# EAGLE schematic CIA_Update.brd (EAGLE 9.7.0)
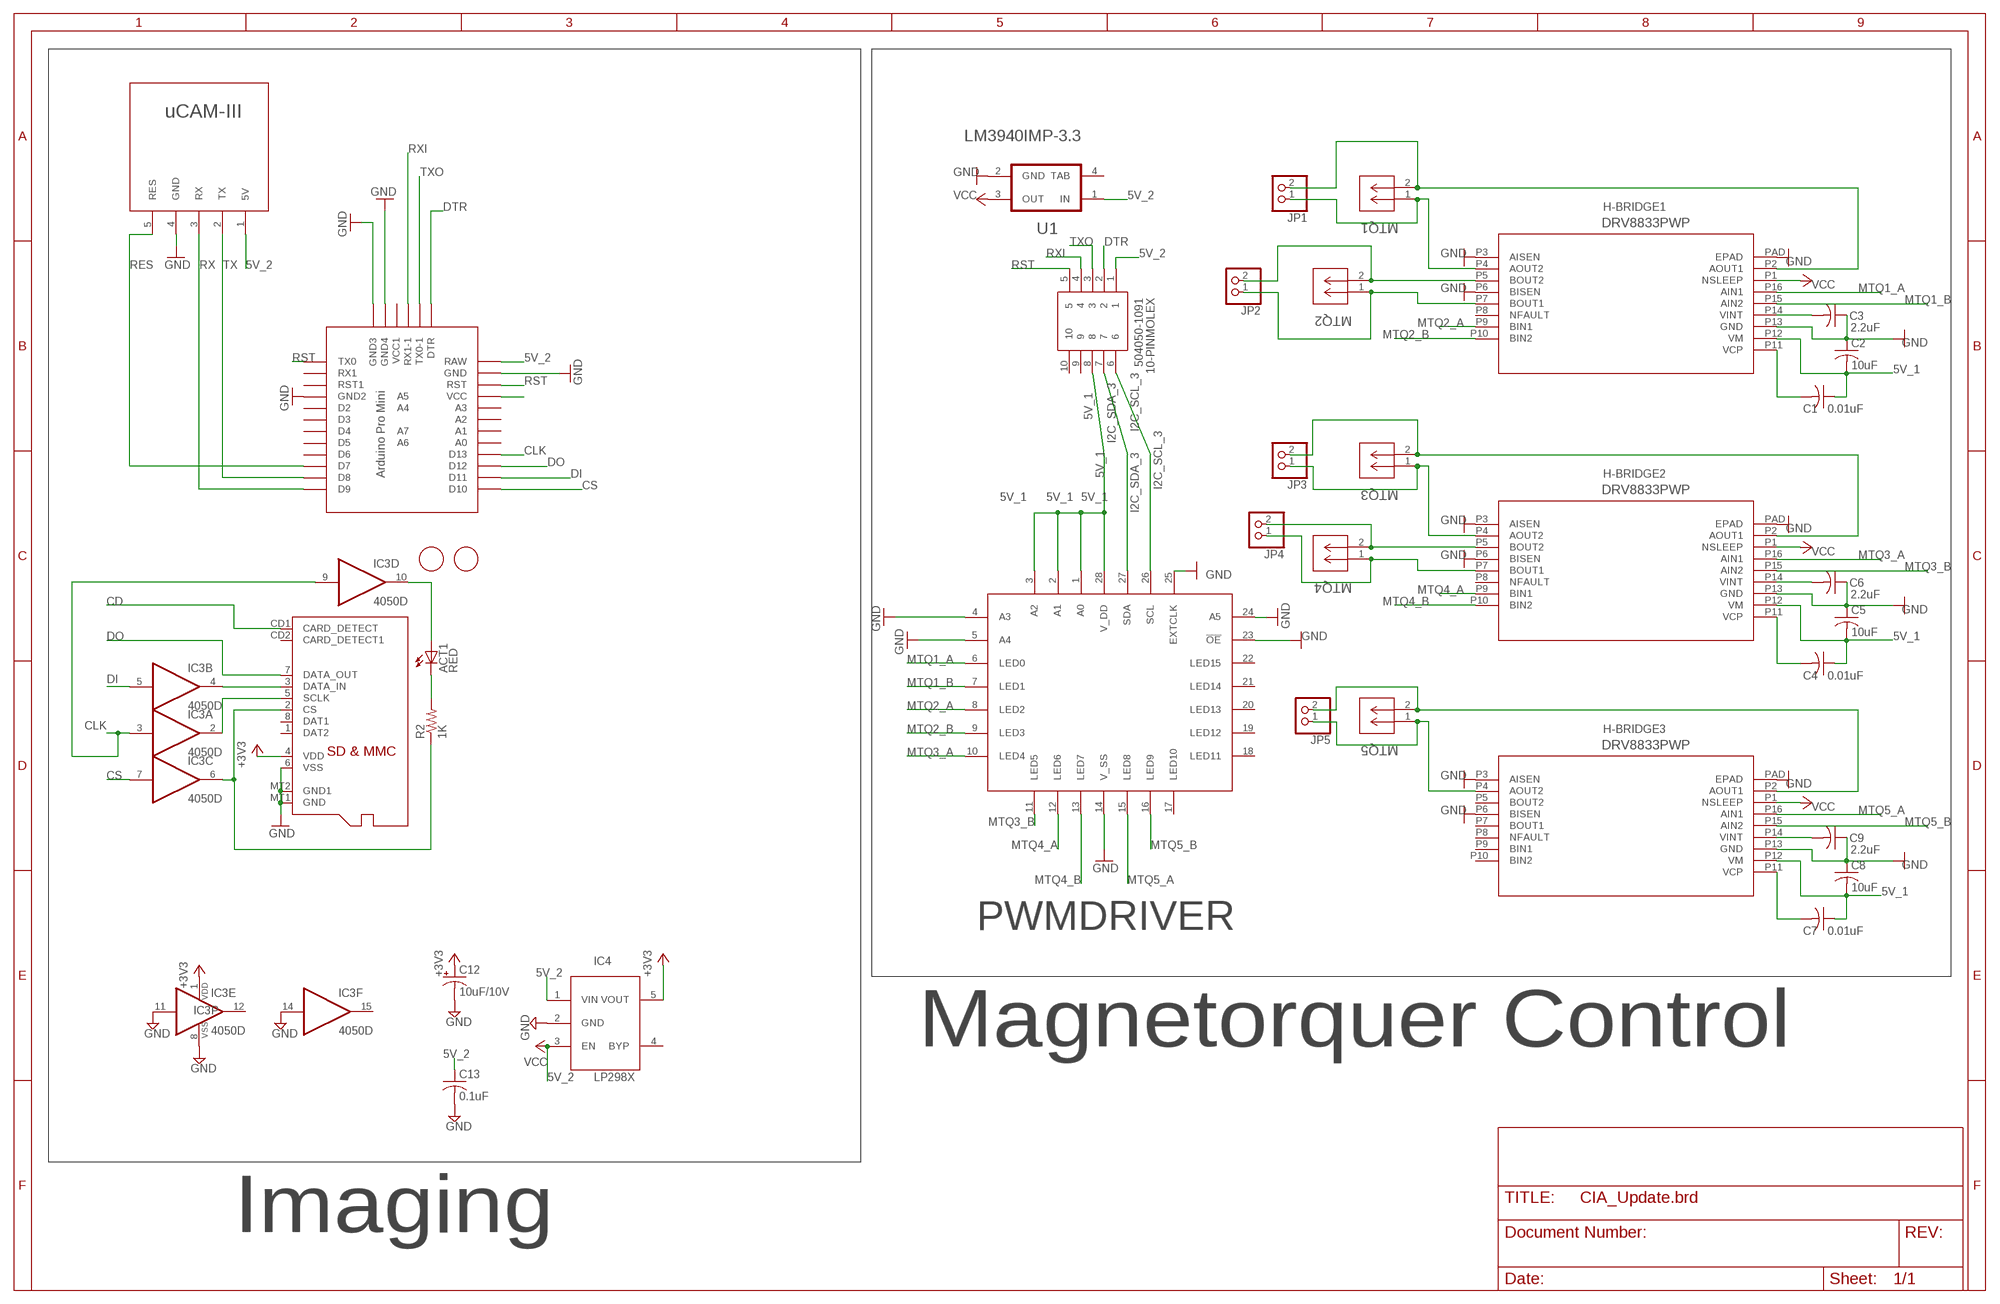
[diagram p0: schematic, sheet 1]

## Parts
10-PINMOLEX  504050-1091  [504050-1091]
ACT1  RED  LEDCHIP-LED0805  [CHIP-LED0805]
C1  0.01uF  C-USC0603K  [C0603K]
C2  10uF  C-USC1210K  [C1210K]
C3  2.2uF  C-USC0603K  [C0603K]
C4  0.01uF  C-USC0603K  [C0603K]
C5  10uF  C-USC1210K  [C1210K]
C6  2.2uF  C-USC0603K  [C0603K]
C7  0.01uF  C-USC0603K  [C0603K]
C8  10uF  C-USC1210K  [C1210K]
C9  2.2uF  C-USC0603K  [C0603K]
C12  10uF/10V  CPOL-USA/3216-18R  [A/3216-18R]
C13  0.1uF  C-USC0805K  [C0805K]
H-BRIDGE1  DRV8833PWP  [HTSSOP16]
H-BRIDGE2  DRV8833PWP  [HTSSOP16]
H-BRIDGE3  DRV8833PWP  [HTSSOP16]
IC3  4050D  [SO16]
IC4  LP298XS  [SOT23-5L]
JP1  PINHD-1X2  [1X02]
JP2  PINHD-1X2  [1X02]
JP3  PINHD-1X2  [1X02]
JP4  PINHD-1X2  [1X02]
JP5  PINHD-1X2  [1X02]
MTQ1  DF13C-2P-1.25V(51)  [CON2_1X2_U_DF13]
MTQ2  DF13C-2P-1.25V(51)  [CON2_1X2_U_DF13]
MTQ3  DF13C-2P-1.25V(51)  [CON2_1X2_U_DF13]
MTQ4  DF13C-2P-1.25V(51)  [CON2_1X2_U_DF13]
MTQ5  DF13C-2P-1.25V(51)  [CON2_1X2_U_DF13]
PWMDRIVER  PCA9685PW  [TSSOP28]
R2  1K  R-US_R0805  [R0805]
U1  TI_NATIONAL_SEMICONDUCTOR_LM3940IMP-3.3TI_NATIONAL_SEMICONDUCTOR_LM3940IMP-3.3_0_1  [TI_NATIONAL_SEMICONDUCTOR_LM3940IMP-3.3_1]
U$2  UCAM-III  [UCAM-III]
U$6  FIDUCIAL  [FIDUCIAL_1MM]
U$7  FIDUCIAL  [FIDUCIAL_1MM]
U$8  PRO-MINI-2  [PRO-MINI-2]
X2  MICROSD  [MICROSD]

## Nets
5V_1 [New Class]: 10-PINMOLEX.8 C1.1 C2.2 C4.1 C5.2 C7.1 C8.2 H-BRIDGE1.P12(VM) H-BRIDGE2.P12(VM) H-BRIDGE3.P12(VM) PWMDRIVER.1(A0) PWMDRIVER.2(A1) PWMDRIVER.3(A2) PWMDRIVER.28(V_DD)
5V_2 [New Class]: 10-PINMOLEX.1 C13.1 IC4.1(VIN) IC4.3(EN) U1.1(IN) U$2.1(5V) U$8.RAW ; supply symbol labelled VCC
+3V3: C12.+ IC3.1(P:VDD) IC4.5(VOUT) X2.4(VDD)
CD: X2.CD1(CARD_DETECT)
CLK: IC3.3(A:I) IC3.9(D:I) U$8.D13
CS: IC3.7(C:I) U$8.D10
DI: IC3.5(B:I) U$8.D11
DO: U$8.D12 X2.7(DATA_OUT)
DTR [MTQs]: 10-PINMOLEX.2 U$8.DTR
GND [MTQs]: C2.1 C3.1 C5.1 C6.1 C8.1 C9.1 C12.- C13.2 H-BRIDGE1.P3(AISEN) H-BRIDGE1.P6(BISEN) H-BRIDGE1.P13(GND) H-BRIDGE1.PAD(EPAD) H-BRIDGE2.P3(AISEN) H-BRIDGE2.P6(BISEN) H-BRIDGE2.P13(GND) H-BRIDGE2.PAD(EPAD) H-BRIDGE3.P3(AISEN) H-BRIDGE3.P6(BISEN) H-BRIDGE3.P13(GND) H-BRIDGE3.PAD(EPAD) IC3.8(P:VSS) IC3.11(E:I) IC3.14(F:I) IC4.2(GND) PWMDRIVER.4(A3) PWMDRIVER.5(A4) PWMDRIVER.14(V_SS) PWMDRIVER.23(!OE) PWMDRIVER.24(A5) PWMDRIVER.25(EXTCLK) U1.2(GND) U$8.GND U$8.GND1(GND2) U$8.GND2(GND3) U$8.GND3(GND4) X2.6(VSS) X2.MT1(GND) X2.MT2(GND1)
I2C_SCL_3: 10-PINMOLEX.6 PWMDRIVER.26(SCL)
I2C_SDA_3: 10-PINMOLEX.7 PWMDRIVER.27(SDA)
MTQ1_A: H-BRIDGE1.P16(AIN1) PWMDRIVER.6(LED0)
MTQ1_B: H-BRIDGE1.P15(AIN2) PWMDRIVER.7(LED1)
MTQ2_A: H-BRIDGE1.P9(BIN1) PWMDRIVER.8(LED2)
MTQ2_B: H-BRIDGE1.P10(BIN2) PWMDRIVER.9(LED3)
MTQ3_A: H-BRIDGE2.P16(AIN1) PWMDRIVER.10(LED4)
MTQ3_B: H-BRIDGE2.P15(AIN2) PWMDRIVER.11(LED5)
MTQ4_A: H-BRIDGE2.P9(BIN1) PWMDRIVER.12(LED6)
MTQ4_B: H-BRIDGE2.P10(BIN2) PWMDRIVER.13(LED7)
MTQ5_A: H-BRIDGE3.P16(AIN1) PWMDRIVER.15(LED8)
MTQ5_B: H-BRIDGE3.P15(AIN2) PWMDRIVER.16(LED9)
N$1 [MTQs]: H-BRIDGE2.P2(AOUT1) JP3.2 MTQ3.2
N$2: C3.2 H-BRIDGE1.P14(VINT)
N$3 [MTQs]: H-BRIDGE1.P4(AOUT2) JP1.1 MTQ1.1
N$4 [MTQs]: H-BRIDGE1.P2(AOUT1) JP1.2 MTQ1.2
N$5 [MTQs]: H-BRIDGE1.P7(BOUT1) JP2.1 MTQ2.1
N$6 [MTQs]: H-BRIDGE1.P5(BOUT2) JP2.2 MTQ2.2
N$7: C1.2 H-BRIDGE1.P11(VCP)
N$8 [MTQs]: H-BRIDGE2.P7(BOUT1) JP4.1 MTQ4.1
N$9 [MTQs]: H-BRIDGE2.P5(BOUT2) JP4.2 MTQ4.2
N$10: C6.2 H-BRIDGE2.P14(VINT)
N$11: C4.2 H-BRIDGE2.P11(VCP)
N$12 [MTQs]: H-BRIDGE2.P4(AOUT2) JP3.1 MTQ3.1
N$13 [MTQs]: H-BRIDGE3.P2(AOUT1) JP5.2 MTQ5.2
N$14 [MTQs]: U$2.4(GND) ; supply symbol labelled GND
N$15: U$8.TX0
N$16: C9.2 H-BRIDGE3.P14(VINT)
N$17: C7.2 H-BRIDGE3.P11(VCP)
N$18 [MTQs]: H-BRIDGE3.P4(AOUT2) JP5.1 MTQ5.1
N$21: U$8.VCC
N$22: ACT1.A IC3.10(D:O)
N$23: IC3.2(A:O) X2.5(SCLK)
N$24: IC3.6(C:O) R2.1 X2.2(CS)
N$25: ACT1.C R2.2
N$26: IC3.4(B:O) X2.3(DATA_IN)
RES: U$2.5(RES) U$8.D7
RST: 10-PINMOLEX.5 U$8.RST
RX: U$2.3(RX) U$8.D9
RXI: 10-PINMOLEX.4 U$8.RX1-1
TX: U$2.2(TX) U$8.D8
TXO: 10-PINMOLEX.3 U$8.TX0-1
VCC: H-BRIDGE1.P1(NSLEEP) H-BRIDGE2.P1(NSLEEP) H-BRIDGE3.P1(NSLEEP) U1.3(OUT)
Unconnected: 10-PINMOLEX.9 10-PINMOLEX.10 H-BRIDGE1.P8(NFAULT) H-BRIDGE2.P8(NFAULT) H-BRIDGE3.P5(BOUT2) H-BRIDGE3.P7(BOUT1) H-BRIDGE3.P8(NFAULT) H-BRIDGE3.P9(BIN1) H-BRIDGE3.P10(BIN2) IC3.12(E:O) IC3.15(F:O) IC4.4(BYP) PWMDRIVER.17(LED10) PWMDRIVER.18(LED11) PWMDRIVER.19(LED12) PWMDRIVER.20(LED13) PWMDRIVER.21(LED14) PWMDRIVER.22(LED15) U$8.A0 U$8.A1 U$8.A2 U$8.A3 U$8.A4 U$8.A5 U$8.A6 U$8.A7 U$8.D2 U$8.D3 U$8.D4 U$8.D5 U$8.D6 U$8.RST1 U$8.RX1 U$8.VCC1 X2.1(DAT2) X2.8(DAT1) X2.CD2(CARD_DETECT1)

## Notes on the sheet
- Magnetorquer Control
- Imaging

## Power pins joined to a net without a drawn wire
TAB: U1.4(TAB)

## Library data of the parts
10-PINMOLEX = molex_10pin:504050-1091: Pico-Lock SMT Wire-to-Board Header 10way Molex 504050 Series, 1.5mm Pitch 10 Way 1 Row Right Angle PCB Header, SMT Termination, 3A Source: Datasheet <https://componentsearchengine.com/Datasheets/1/504050-1091.pdf>; DESCRIPTION: Pico-Lock SMT Wire-to-Board Header 10way Molex 504050 Series, 1.5mm Pitch 10 Way 1 Row Right Angle PCB Header, SMT Termination, 3A; HEIGHT: mm; MANUFACTURER_NAME: Molex; MANUFACTURER_PART_NUMBER: 504050-1091; MOUSER_PART_NUMBER: 538-504050-1091; MOUSER_PRICE-STOCK: https://www.mouser.com/Search/Refine.aspx?Keyword=538-504050-1091; OC_NEWARK: unknown
ACT1 = adafruit:LED: LED OSRAM: - CHIPLED LG R971, LG N971, LY N971, LG Q971, LY Q971, LO R971, LY R971 LH N974, LH R974 LS Q976, LO Q976, LY Q976 LO Q996 - Hyper CHIPLED LW Q18S LB Q993, LB Q99A, LB R99A - SideLED LS A670, LO A670, LY A670, LG A670, LP A670 LB A673, LV A673, LT A673, LW A673 LH A674 LY A675 LS A676, LA A676, LO A676, LY A676, LW A676 LS A679, LY A679, LG A679 - Hyper Micro SIDELED® LS Y876, LA Y876, LO Y876, LY Y876 LT Y87S - SmartLED LW L88C, LW L88S LB L89C, LB L89S, LG L890 LS L89K, LO L89K, LY L89K LS L896, LA L896, LO L896, LY L896 - TOPLED LS T670, LO T670, LY T670, LG T670, LP T670 LSG T670, LSP T670, LSY T670, LOP T670, LYG T670 LG T671, LOG T671, LSG T671 LB T673, LV T673, LT T673, LW T673 LH T674 LS T676, LA T676, LO T676, LY T676, LB T676, LH T676, LSB T676, LW T676 LB T67C, LV T67C, LT T67C, LS T67K, LO T67K, LY T67K, LW E67C LS E67B, LA E67B, LO E67B, LY E67B, LB E67C, LV E67C, LT E67C LW T67C LS T679, LY T679, LG T679 LS T770, LO T770, LY T770, LG T770, LP T770 LB T773, LV T773, LT T773, LW T773 LH T774 LS E675, LA E675, LY E675, LS T675 LS T776, LA T776, LO T776, LY T776, LB T776 LHGB T686 LT T68C, LB T68C - Hyper Mini TOPLED® LB M676 - Mini TOPLED Santana® LG M470 LS M47K, LO M47K, LY M47K Source: http://www.osram.convergy.de/; OC_NEWARK: unknown
C1-C9 = rcl:C-US: CAPACITOR, American symbol; OC_NEWARK: unknown; SPICEPREFIX: C
C12 = adafruit:CPOL-US: POLARIZED CAPACITOR, American symbol; OC_NEWARK: unknown
C13 = adafruit:C-US: CAPACITOR, American symbol; OC_NEWARK: unknown
H-BRIDGE1-H-BRIDGE3 = myparts:DRV8833PWP; OC_NEWARK: unknown
IC3 = 40xx:4050: Hex non-inverting BUFFER; OC_NEWARK: unknown
IC4 = adafruit:LP298X; OC_NEWARK: unknown
JP1-JP5 = pinhead:PINHD-1X2: PIN HEADER; MF: MOLEX; MPN: 22-11-2022; OC_NEWARK: 55H9825
MTQ1-MTQ5 = myparts:DF13C-2P-1.25V(51); BUILT_BY: EMA_UL_Team; MANUFACTURER_PART_NUMBER: DF13C-2P-1.25V(51); OC_NEWARK: unknown; VENDOR: Hirose
PWMDRIVER = myparts:PCA9685PW; OC_NEWARK: unknown
R2 = adafruit:R-US_: RESISTOR, American symbol; OC_NEWARK: unknown
U1 = TI National Semiconductor - LM3940IMP-3.3:TI_NATIONAL_SEMICONDUCTOR_LM3940IMP-3.3: PM-REG-LM2940-TO4; CIIVA_IDS: 1170636; CODE__IPC: SOT223-4; CODE__JEDEC: TO-261-AA; COMPONENT_LINK_1_DESCRIPTION: Datasheet URL; COMPONENT_LINK_1_URL: http://www.ti.com/general/docs/lit/getliterature.tsp?genericPartNumber=LM3940&fileType=pdf; COMP_TYPE: LDO IC; FOOTPRINT_VARIANT_NAME_0: Level C; FOOTPRINT_VARIANT_NAME_1: Level B; FOOTPRINT_VARIANT_NAME_2: Level A; IMPORTED: yes; IMPORTED_FROM: vault; IMPORT_TS: 1521848719; MF: TI National Semiconductor; MPN: LM3940IMP-3.3; PACKAGE: DCY0004A; PACKAGE_DESCRIPTION: Molded SOT-223, 6.50 x 3.56 x 1.6mm Body, 4 Lead, 2.3mm Pitch; PACKAGE_TOP_MARKING: XYTT*L52B; PIN_COUNT: 4; POWER_WISE: N; PREFIX: U; RELEASE_DATE: 1464091660; ROHS: No; VAULT_GUID: 7D174BE9-4519-4BE6-B3E4-802F171613CA; VAULT_REVISION: 33897558-4D8B-46BE-97DA-B950EC492A4C
U$2 = myparts:UCAM-III; OC_NEWARK: unknown
U$6 U$7 = adafruit:FIDUCIAL: For use by pick and place machines to calibrate the vision/machine, 1mm By microbuilder.eu; OC_NEWARK: unknown
U$8 = myparts:PRO-MINI-2: Arduino Pro Mini Layout 2 Sparkfun.com; OC_NEWARK: unknown
X2 = adafruit:MICROSD: Micro-SD / Transflash card holder with SPI pinout For the 3M # 2908-05WB-MG and/or 4UCON #19656 push-push type; OC_NEWARK: unknown

## Net classes
0 default: width 0.152 mm
1 New Class: width 0.457 mm
2 MTQs: width 0.305 mm